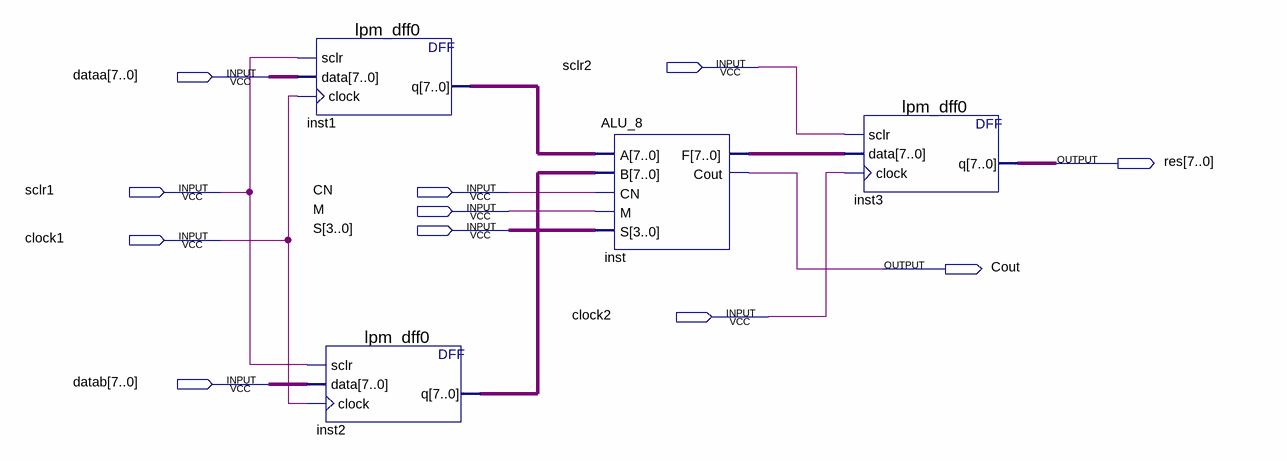
[diagram p0: schematic sheet]
// Quartus schematic rom_cal.bdf as structural Verilog: 4 symbols, 11 pins
module rom_cal (
  input  sclr2,
  input  [7:0] dataa,
  input  sclr1,
  input  CN,
  input  M,
  input  [3:0] S,
  input  clock1,
  input  clock2,
  input  [7:0] datab,
  output [7:0] res,
  output Cout
);

  wire [7:0] inst1_q, inst2_q, inst_f;

  lpm_dff0 inst1 (.sclr(sclr1), .data(dataa), .clock(clock1), .q(inst1_q));
  lpm_dff0 inst2 (.sclr(sclr1), .data(datab), .clock(clock1), .q(inst2_q));
  ALU_8 inst (.A(inst1_q), .B(inst2_q), .CN(CN), .M(M), .S(S), .F(inst_f), .Cout(Cout));
  lpm_dff0 inst3 (.sclr(sclr2), .data(inst_f), .clock(clock2), .q(res));
endmodule
